# Altium schematic sheet UCC14240 Test Board.SchDoc: UCC14240 Breakout Board
size A4; Author: Chawthri K; Organization: Waterloop; Address1: University of Waterloo; Address2: 200 University Ave W; Address3: Waterloo, ON; Address4: N2L 3G1; Revision: 1.0; SheetNumber: 1; SheetTotal: 1
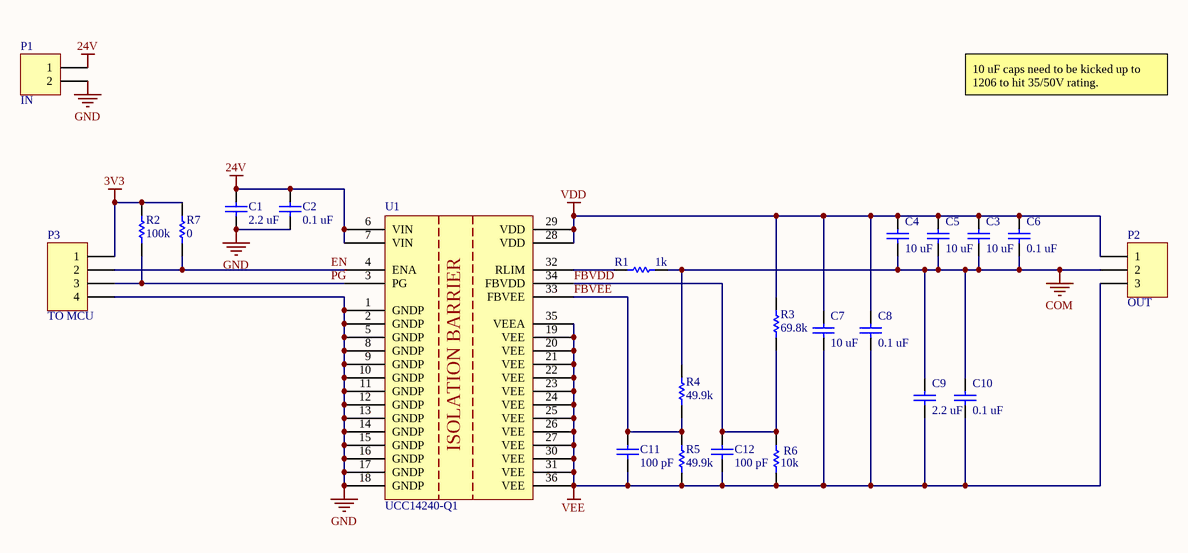
[diagram p0: UCC14240 Test Board.SchDoc]

## Parts
C1  value 2.2 uF  [0805 - Capacitor]  (hidden comment: Capacitor - Nonpolarized)
C2  value 0.1 uF  [0805 - Capacitor]  (hidden comment: Capacitor - Nonpolarized)
C3  value 10 uF  [0805 - Capacitor]  (hidden comment: Capacitor - Nonpolarized)
C4  value 10 uF  [0805 - Capacitor]  (hidden comment: Capacitor - Nonpolarized)
C5  value 10 uF  [0805 - Capacitor]  (hidden comment: Capacitor - Nonpolarized)
C6  value 0.1 uF  [0805 - Capacitor]  (hidden comment: Capacitor - Nonpolarized)
C7  value 10 uF  [0805 - Capacitor]  (hidden comment: Capacitor - Nonpolarized)
C8  value 0.1 uF  [0805 - Capacitor]  (hidden comment: Capacitor - Nonpolarized)
C9  value 2.2 uF  [0805 - Capacitor]  (hidden comment: Capacitor - Nonpolarized)
C10  value 0.1 uF  [0805 - Capacitor]  (hidden comment: Capacitor - Nonpolarized)
C11  value 100 pF  [0603 - Capacitor]  (hidden comment: Capacitor - Nonpolarized)
C12  value 100 pF  [0603 - Capacitor]  (hidden comment: Capacitor - Nonpolarized)
P1  IN  [HDR1X2]
P2  OUT  [HDR1X3]
P3  TO MCU  [HDR1X4]
R1  value 1k  [0805 - Resistor]  (hidden comment: Resistor)
R2  value 100k  [0603 - Resistor]  (hidden comment: Resistor)
R3  value 69.8k  [0603 - Resistor]  (hidden comment: Resistor)
R4  value 49.9k  [0603 - Resistor]  (hidden comment: Resistor)
R5  value 49.9k  [0603 - Resistor]  (hidden comment: Resistor)
R6  value 10k  [0603 - Resistor]  (hidden comment: Resistor)
R7  value 0  [0603 - Resistor]  (hidden comment: Resistor)
U1  UCC14240-Q1  [SOP65P1020X355-36N]

## Nets
3V3: P3.1 R2.2 R7.2
24V: C1.2 C2.2 P1.1 U1.6(VIN) U1.7(VIN)
COM: C3.1 C4.1 C5.1 C6.1 C9.2 C10.2 P2.2 R1.2 R4.2
GND: C1.1 C2.1 P1.2 P3.4 U1.1(GNDP) U1.2(GNDP) U1.5(GNDP) U1.8(GNDP) U1.9(GNDP) U1.10(GNDP) U1.11(GNDP) U1.12(GNDP) U1.13(GNDP) U1.14(GNDP) U1.15(GNDP) U1.16(GNDP) U1.17(GNDP) U1.18(GNDP)
VDD: C3.2 C4.2 C5.2 C6.2 C7.2 C8.2 P2.1 R3.2 U1.28(VDD) U1.29(VDD)
VEE: C7.1 C8.1 C9.1 C10.1 C11.1 C12.1 P2.3 R5.1 R6.1 U1.19(VEE) U1.20(VEE) U1.21(VEE) U1.22(VEE) U1.23(VEE) U1.24(VEE) U1.25(VEE) U1.26(VEE) U1.27(VEE) U1.30(VEE) U1.31(VEE) U1.35(VEEA) U1.36(VEE)
EN: P3.2 R7.1 U1.4(ENA)
FBVDD: C12.2 R3.1 R6.2 U1.34(FBVDD)
FBVEE: C11.2 R4.1 R5.2 U1.33(FBVEE)
~{PG}: P3.3 R2.1 U1.3(PG)
NetR1_1: R1.1 U1.32(RLIM)

## Notes on the sheet
- 10 uF caps need to be kicked up to 1206 to hit 35/50V rating.
- Title:
- Size:
- Date:
- A4
- Author:
- Revision:
- Sheet
- of
- File:
- (in symbol UCC14240-Q1) ISOLATION BARRIER

## Library data of the parts
C1 C9 = Capacitor - Nonpolarized: Nonpolarized Capacitor; Manufacturer: Samsung; Manufacturer Part Number: CL21A225KBFNNNE; Rating: 50V; Supplier Part Number: 1276-6702-1-ND; Supplier: Digikey
C2 C6 C8 C10 = Capacitor - Nonpolarized: Nonpolarized Capacitor; Manufacturer: Yageo; Manufacturer Part Number: CC0805KRX7R9BB104; Rating: 50V; Supplier Part Number: 311-1140-1-ND; Supplier: Digkey
C3-C5 C7 = Capacitor - Nonpolarized: Nonpolarized Capacitor; Manufacturer: Samsung; Manufacturer Part Number: CL31A106MBHNNNE; Rating: 50V; Supplier Part Number: 1276-6736-1-ND; Supplier: Digikey
C11 C12 = Capacitor - Nonpolarized: Nonpolarized Capacitor; Manufacturer: Yageo; Manufacturer Part Number: CC0603JRNPO9BN101; Rating: 50V; Supplier Part Number: 311-1069-1-ND; Supplier: Digikey
P1 = 1x2 Header: 1x2 Pin Header
P2 = 1x3 Header: 1x3 Pin Header
P3 = 1x4 Header: 1x4 Pin Header
R1 = Resistor: Manufacturer Part Number: RNCP0805FTD1K00; Manufacturer: Stackpole; Rating: 1/4W; Supplier Part Number: RNCP0805FTD1K00CT-ND; Supplier: Digikey
R2 = Resistor: Manufacturer Part Number: RC0603FR-07100KL; Manufacturer: Yageo; Rating: 1/10W; Supplier Part Number: RC0603FR-07100KL; Supplier: Digikey
R3 = Resistor: Manufacturer Part Number: RC0603FR-0769K8L; Manufacturer: Yageo; Rating: 1/10W; Supplier Part Number: 311-69.8KHRCT-ND; Supplier: Digikey
R4 R5 = Resistor: Manufacturer Part Number: RMCF0603FG49K9; Manufacturer: Stackpole; Rating: 1/16W; Supplier Part Number: RMCF0603FG49K9CT-ND; Supplier: Digikey
R6 = Resistor: Manufacturer Part Number: RC0603FR-0710KL; Manufacturer: Yageo; Rating: 1/10W; Supplier Part Number: 311-10.0KHRCT-ND; Supplier: Digikey
R7 = Resistor: Manufacturer Part Number: CR0603-J/-000ELF; Manufacturer: Bourns; Rating: 1/10W; Supplier Part Number: CR0603-J/-000ELFCT-ND; Supplier: Digikey
U1 = UCC14240-Q1: Isolated DC/DC Converter with Integrated Transformer; Manufacturer: Texas Instruments; MPN: UCC14240-Q1; ComponentLink1Description: Datasheet; ComponentLink1URL: https://www.ti.com/lit/ds/symlink/ucc14240-q1.pdf?ts=1634091484132&ref_url=https%253A%252F%252Fwww.ti.com%252Fproduct%252FUCC14240-Q1; Digikey Part Number: *; Mouser Part Number: *